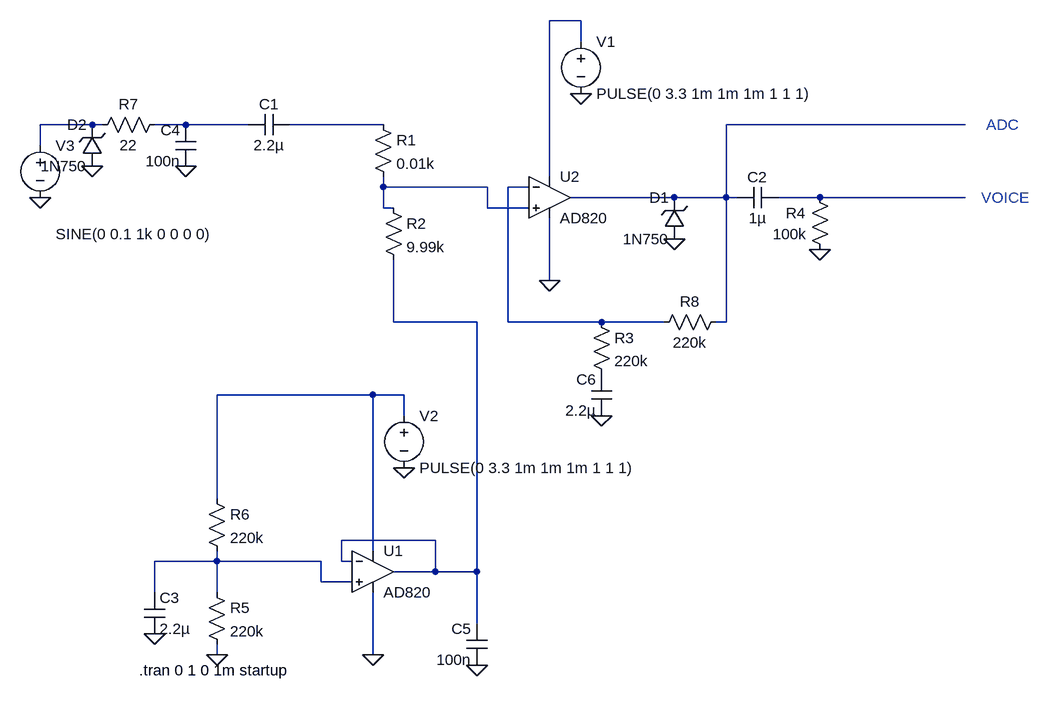
[diagram p0: schematic single_rail_amp_trans_non.asc]
single_rail_amp_trans_non.asc, the LTspice schematic file:
Version 4
SHEET 1 900 872
WIRE 208 -144 160 -144
WIRE 208 -112 208 -144
WIRE -544 16 -624 16
WIRE -528 16 -544 16
WIRE -400 16 -448 16
WIRE -304 16 -400 16
WIRE -96 16 -240 16
WIRE 800 16 432 16
WIRE -624 48 -624 16
WIRE 160 96 160 -144
WIRE -96 112 -96 96
WIRE 64 112 -96 112
WIRE 128 112 96 112
WIRE 352 128 192 128
WIRE 432 128 432 16
WIRE 432 128 352 128
WIRE 448 128 432 128
WIRE 576 128 512 128
WIRE 800 128 576 128
WIRE -96 144 -96 112
WIRE -80 144 -96 144
WIRE 64 144 64 112
WIRE 128 144 64 144
WIRE 160 256 160 160
WIRE -80 320 -80 224
WIRE 48 320 -80 320
WIRE 96 320 96 112
WIRE 240 320 96 320
WIRE 336 320 240 320
WIRE 432 320 432 128
WIRE 432 320 416 320
WIRE -112 432 -352 432
WIRE -64 432 -112 432
WIRE -64 464 -64 432
WIRE -352 592 -352 432
WIRE -16 656 -160 656
WIRE -112 672 -112 432
WIRE -352 688 -352 672
WIRE -352 688 -448 688
WIRE -192 688 -352 688
WIRE -160 688 -160 656
WIRE -144 688 -160 688
WIRE -16 704 -16 656
WIRE -16 704 -80 704
WIRE 48 704 48 320
WIRE 48 704 -16 704
WIRE -192 720 -192 688
WIRE -144 720 -192 720
WIRE -448 736 -448 688
WIRE -352 736 -352 688
WIRE 48 784 48 704
WIRE -352 832 -352 816
WIRE -112 832 -112 736
FLAG 160 256 0
FLAG 208 -32 0
FLAG -112 832 0
FLAG -64 544 0
FLAG -448 800 0
FLAG -352 832 0
FLAG -624 128 0
FLAG 576 208 0
FLAG -400 80 0
FLAG 48 848 0
FLAG -544 80 0
FLAG 352 192 0
FLAG 240 464 0
SYMBOL voltage 208 -128 R0
WINDOW 123 0 0 Left 0
WINDOW 39 0 0 Left 0
SYMATTR InstName V1
SYMATTR Value PULSE(0 3.3 1m 1m 1m 1 1 1)
SYMBOL cap -240 0 R90
WINDOW 0 0 32 VBottom 2
WINDOW 3 32 32 VTop 2
SYMATTR InstName C1
SYMATTR Value 2.2µ
SYMBOL voltage -64 448 R0
WINDOW 123 0 0 Left 0
WINDOW 39 0 0 Left 0
SYMATTR InstName V2
SYMATTR Value PULSE(0 3.3 1m 1m 1m 1 1 1)
SYMBOL res -368 720 R0
SYMATTR InstName R5
SYMATTR Value 220k
SYMBOL res -368 576 R0
SYMATTR InstName R6
SYMATTR Value 220k
SYMBOL cap -464 736 R0
SYMATTR InstName C3
SYMATTR Value 2.2µ
SYMBOL voltage -624 32 R0
WINDOW 3 24 152 Left 2
WINDOW 123 24 124 Left 2
WINDOW 39 0 0 Left 0
SYMATTR Value SINE(0 0.1 1k 0 0 0 0)
SYMATTR InstName V3
SYMBOL cap 512 112 R90
WINDOW 0 0 32 VBottom 2
WINDOW 3 32 32 VTop 2
SYMATTR InstName C2
SYMATTR Value 1µ
SYMBOL res 592 224 R180
WINDOW 0 38 72 Left 2
WINDOW 3 36 40 Left 2
SYMATTR InstName R4
SYMATTR Value 100k
SYMBOL res -544 32 R270
WINDOW 0 32 56 VTop 2
WINDOW 3 0 56 VBottom 2
SYMATTR InstName R7
SYMATTR Value 22
SYMBOL cap -384 80 R180
WINDOW 0 24 56 Left 2
WINDOW 3 24 8 Left 2
SYMATTR InstName C4
SYMATTR Value 100n
SYMBOL OpAmps\\AD820 -112 640 R0
SYMATTR InstName U1
SYMBOL OpAmps\\AD820 160 64 R0
SYMATTR InstName U2
SYMBOL cap 64 848 R180
WINDOW 0 24 56 Left 2
WINDOW 3 24 8 Left 2
SYMATTR InstName C5
SYMATTR Value 100n
SYMBOL zener 368 192 R180
WINDOW 0 24 64 Left 2
WINDOW 3 24 0 Left 2
SYMATTR InstName D1
SYMATTR Value 1N750
SYMBOL zener -528 80 R180
WINDOW 0 24 64 Left 2
WINDOW 3 24 0 Left 2
SYMATTR InstName D2
SYMATTR Value 1N750
SYMBOL res -112 0 R0
SYMATTR InstName R1
SYMATTR Value 0.01k
SYMBOL res -96 128 R0
SYMATTR InstName R2
SYMATTR Value 9.99k
SYMBOL res 224 304 R0
SYMATTR InstName R3
SYMATTR Value 220k
SYMBOL res 432 304 R90
WINDOW 0 0 56 VBottom 2
WINDOW 3 32 56 VTop 2
SYMATTR InstName R8
SYMATTR Value 220k
SYMBOL cap 256 464 R180
WINDOW 0 24 56 Left 2
WINDOW 3 24 8 Left 2
SYMATTR InstName C6
SYMATTR Value 2.2µ
TEXT -472 856 Left 2 !.tran 0 1 0 1m startup
TEXT 832 16 Left 2 ;ADC
TEXT 824 128 Left 2 ;VOICE

The netlist it stands for:
* single_rail_amp_trans_non.asc
V1 N001 0 PULSE(0 3.3 1m 1m 1m 1 1 1)
C1 N004 N003 2.2µ
V2 N010 0 PULSE(0 3.3 1m 1m 1m 1 1 1)
R5 N011 0 220k
R6 N010 N011 220k
C3 N011 0 2.2µ
V3 N002 0 SINE(0 0.1 1k 0 0 0 0)
C2 N008 N005 1µ
R4 0 N008 100k
R7 N002 N003 22
C4 0 N003 100n
XU1 N011 N009 N010 0 N009 AD820  ; pins In+ In- V+ V- OUT
XU2 N006 N007 N001 0 N005 AD820  ; pins In+ In- V+ V- OUT
C5 0 N009 100n
D1 0 N005 1N750
D2 0 N002 1N750
R1 N004 N006 0.01k
R2 N006 N009 9.99k
R3 N007 P001 220k
R8 N005 N007 220k
C6 0 P001 2.2µ
.model D D
.lib standard.dio
.tran 0 1 0 1m startup
* ADC
* VOICE
.backanno
.end